# Altium schematic sheet LOAD_SWITCH_5V.SchDoc: LOAD SWITCH 5V
size A3; Author: Silvio Navaretti; CompanyName: ARDUINO; DrawnBy: Silvio Navaretti; Engineer: Silvio Navaretti; Organization: ARDUINO; SheetNumber: 28; SheetTotal: 51; RevAuthor: Silvio Navaretti
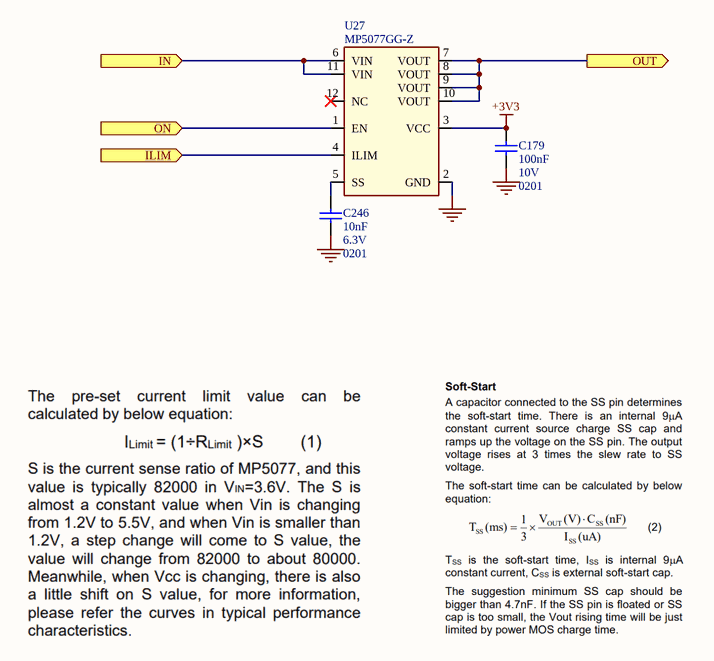
[diagram p0: LOAD_SWITCH_5V.SchDoc]

## Parts
C179  value 100nF  Voltage: 10V  Case Code (Imperial): 0201  [CAP-0201]  (hidden comment: CL03A104KP3NNNC)
C246  value 10nF  Voltage: 6.3V  Case Code (Imperial): 0201  [CAP-0201]  (hidden comment: GRM033R70J103KA01D)
U27  MP5077GG-Z  [MPS QFN12 2x2mm pitch 0.4mm]

## Ports
ILIM (in), IN (in), ON (in), OUT (out)

## Nets
+3V3: C179.2 U27.3(VCC)
GND: C179.1 C246.1 U27.2(GND)
ILIM: U27.4(ILIM) ; port ILIM
IN: U27.6(VIN) U27.11(VIN) ; port IN
ON: U27.1(EN) ; port ON
OUT: U27.7(VOUT) U27.8(VOUT) U27.9(VOUT) U27.10(VOUT) ; port OUT
NetC246_2: C246.2 U27.5(SS)

Not connected (* = marked no-connect by the designer): U27 12(NC)*

## Notes on the sheet
- Title:
- ID:
- Date:
- Time:
- Version:
- Sheet
- of
- RevAuthor:
- Reference Designs ARE PROVIDED "AS IS" AND "WITH ALL FAULTS. Arduino SA DISCLAIMS ALL OTHER WARRANTIES, EXPRESS OR IMPLIED, REGARDING PRODUCTS, INCLUDING BUT NOT LIMITED TO, ANY IMPLIED WARRANTIES OF MERCHANTABILITY OR FITNESS FOR A PARTICULAR PURPOSE.
  Arduino SA may make changes to specifications and product descriptions at any time, without notice. The Customer must not rely on the absence or characteristics of any features or instructions marked "reserved" or "undefined".
  Arduino SA reserves these for future definition and shall have no responsibility whatsoever for conflicts or incompatibilities arising from future changes to them. The product information on the Web Site or Materials is subject to change without notice.
  Do not finalize a design with this info. ARDUINO and other Arduino brands and logos and Trademarks of Arduino SA. All Arduino SA Trademarks cannot be used without owner's formal permission.
- File:
- Author:

## Library data of the parts
C179 = C0113-A.6: CAP CHIP 0201 100nF 10% 10V X5R; Manufacturer: Samsung Electro-Mechanics; Code Arduino: C0113; Technology: Ceramic; Part Number: CL03A104KP3NNNC; Dielectric: X5R; Tolerance: 10%
C246 = C0112-A.6: CAP CHIP 0201 10nF 10% 6.3V X7R; Manufacturer: Murata; Code Arduino: C0112; Tolerance: 10%; Part Number: GRM033R70J103KA01D; Manufacturer 2: Yageo; Technology: Ceramic; Dielectric: X7R
U27 = U0512-A.2: IC Load Switch Vload 0.5V to 5.5V, 10mR at 5V, max 7A, programmable overcurrent limit, linear ramp control, logic ON 1.7V, VCC 3V to 5.5V, -40 to 125°C, QFN12 2x2mm; Manufacturer: MPS; Code Arduino: U0512; Part Number: MP5077GG-Z